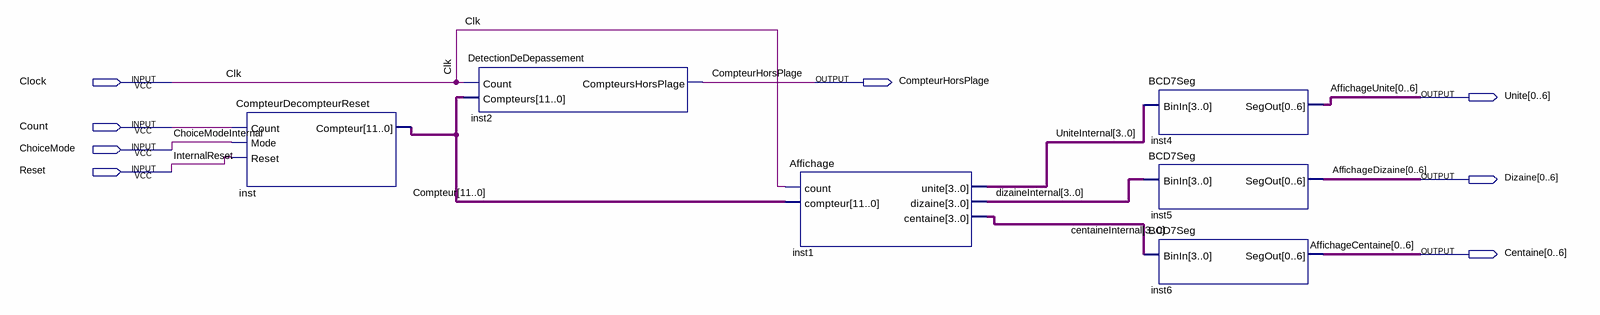
[diagram p0: schematic sheet]
// Quartus schematic CompteurDecompteur.bdf as structural Verilog: 6 symbols, 8 pins
module CompteurDecompteur (
  input  Clock,
  input  Count,
  input  ChoiceMode,
  input  Reset,
  output CompteurHorsPlage,
  output [0:6] Unite,
  output [0:6] Dizaine,
  output [0:6] Centaine
);

  wire [3:0] centaineInternal, dizaineInternal, UniteInternal;
  wire [11:0] Compteur;

  CompteurDecompteurReset inst (.Count(Count), .Mode(ChoiceMode), .Reset(Reset), .Compteur(Compteur));
  DetectionDeDepassement inst2 (.Count(Clock), .Compteurs(Compteur), .CompteursHorsPlage(CompteurHorsPlage));
  Affichage inst1 (
    .count(Clock), .compteur(Compteur), .unite(UniteInternal), .dizaine(dizaineInternal),
    .centaine(centaineInternal));
  BCD7Seg inst4 (.BinIn(UniteInternal), .SegOut(Unite));
  BCD7Seg inst5 (.BinIn(dizaineInternal), .SegOut(Dizaine));
  BCD7Seg inst6 (.BinIn(centaineInternal), .SegOut(Centaine));

  // Other names for the same wires on the sheet: AffichageCentaine[6:0] = {Centaine[6], Centaine[5], Centaine[4], Centaine[3], Centaine[2], Centaine[1], Centaine[0]};
  //   AffichageDizaine[6:0] = {Dizaine[6], Dizaine[5], Dizaine[4], Dizaine[3], Dizaine[2], Dizaine[1], Dizaine[0]};
  //   ChoiceModeInternal = ChoiceMode; Clk = Clock; InternalReset = Reset;
  //   AffichageUnite[6:0] = {Unite[6], Unite[5], Unite[4], Unite[3], Unite[2], Unite[1], Unite[0]}
endmodule
